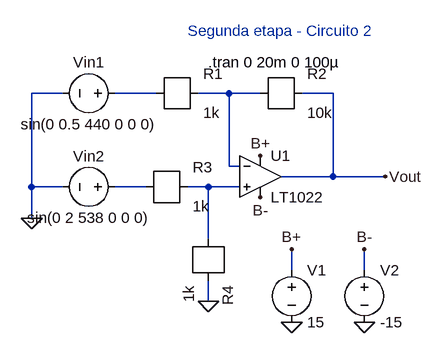
[diagram p0: schematic Lab3_2_2.asc]
Lab3_2_2.asc, the LTspice schematic file:
Version 4
SHEET 1 880 680
WIRE 144 224 96 224
WIRE 288 224 224 224
WIRE 400 224 352 224
WIRE 448 224 400 224
WIRE 560 224 512 224
WIRE 400 336 400 224
WIRE 416 336 400 336
WIRE 560 352 560 224
WIRE 560 352 480 352
WIRE 640 352 560 352
WIRE 96 368 96 224
WIRE 144 368 96 368
WIRE 272 368 224 368
WIRE 368 368 336 368
WIRE 416 368 368 368
WIRE 96 416 96 368
WIRE 368 448 368 368
WIRE 496 496 496 464
WIRE 608 496 608 464
WIRE 368 544 368 512
FLAG 608 576 0
FLAG 496 576 0
FLAG 608 464 B-
FLAG 496 464 B+
FLAG 448 384 B-
FLAG 448 320 B+
FLAG 640 352 Vout
FLAG 96 416 0
FLAG 368 544 0
SYMBOL opamps/LT1022 448 288 R0
SYMATTR InstName U1
SYMBOL voltage 496 480 R0
SYMATTR InstName V1
SYMATTR Value 15
SYMBOL voltage 608 480 R0
SYMATTR InstName V2
SYMATTR Value -15
SYMBOL r 288 224 R0
SYMATTR InstName R1
SYMATTR Value 1k
SYMBOL r 448 224 R0
SYMATTR InstName R2
SYMATTR Value 10k
SYMBOL voltage 240 224 R90
WINDOW 0 -32 56 VBottom 2
WINDOW 3 32 56 VTop 2
SYMATTR InstName Vin1
SYMATTR Value sin(0 0.5 440 0 0 0)
SYMBOL voltage 240 368 R90
WINDOW 0 -32 56 VBottom 2
WINDOW 3 32 56 VTop 2
SYMATTR InstName Vin2
SYMATTR Value sin(0 2 538 0 0 0)
SYMBOL r 272 368 R0
SYMATTR InstName R3
SYMATTR Value 1k
SYMBOL r 368 448 R90
SYMATTR InstName R4
SYMATTR Value 1k
TEXT 336 128 Left 2 ;Segunda etapa - Circuito 2
TEXT 368 176 Left 2 !.tran 0 20m 0 100µ

The netlist it stands for:
* Lab3_2_2.asc
XU1 N004 N002 B+ B- Vout LT1022  ; pins In+ In- V+ V- OUT
V1 B+ 0 15
V2 B- 0 -15
R1 N002 N001 1k
R2 Vout N002 10k
Vin1 N001 0 sin(0 0.5 440 0 0 0)
Vin2 N003 0 sin(0 2 538 0 0 0)
R3 N004 N003 1k
R4 0 N004 1k
* Segunda etapa - Circuito 2
.tran 0 20m 0 100µ
.backanno
.end